# EAGLE design H0BR41 (EAGLE 9.6.2)

## Sheet 1 of 2
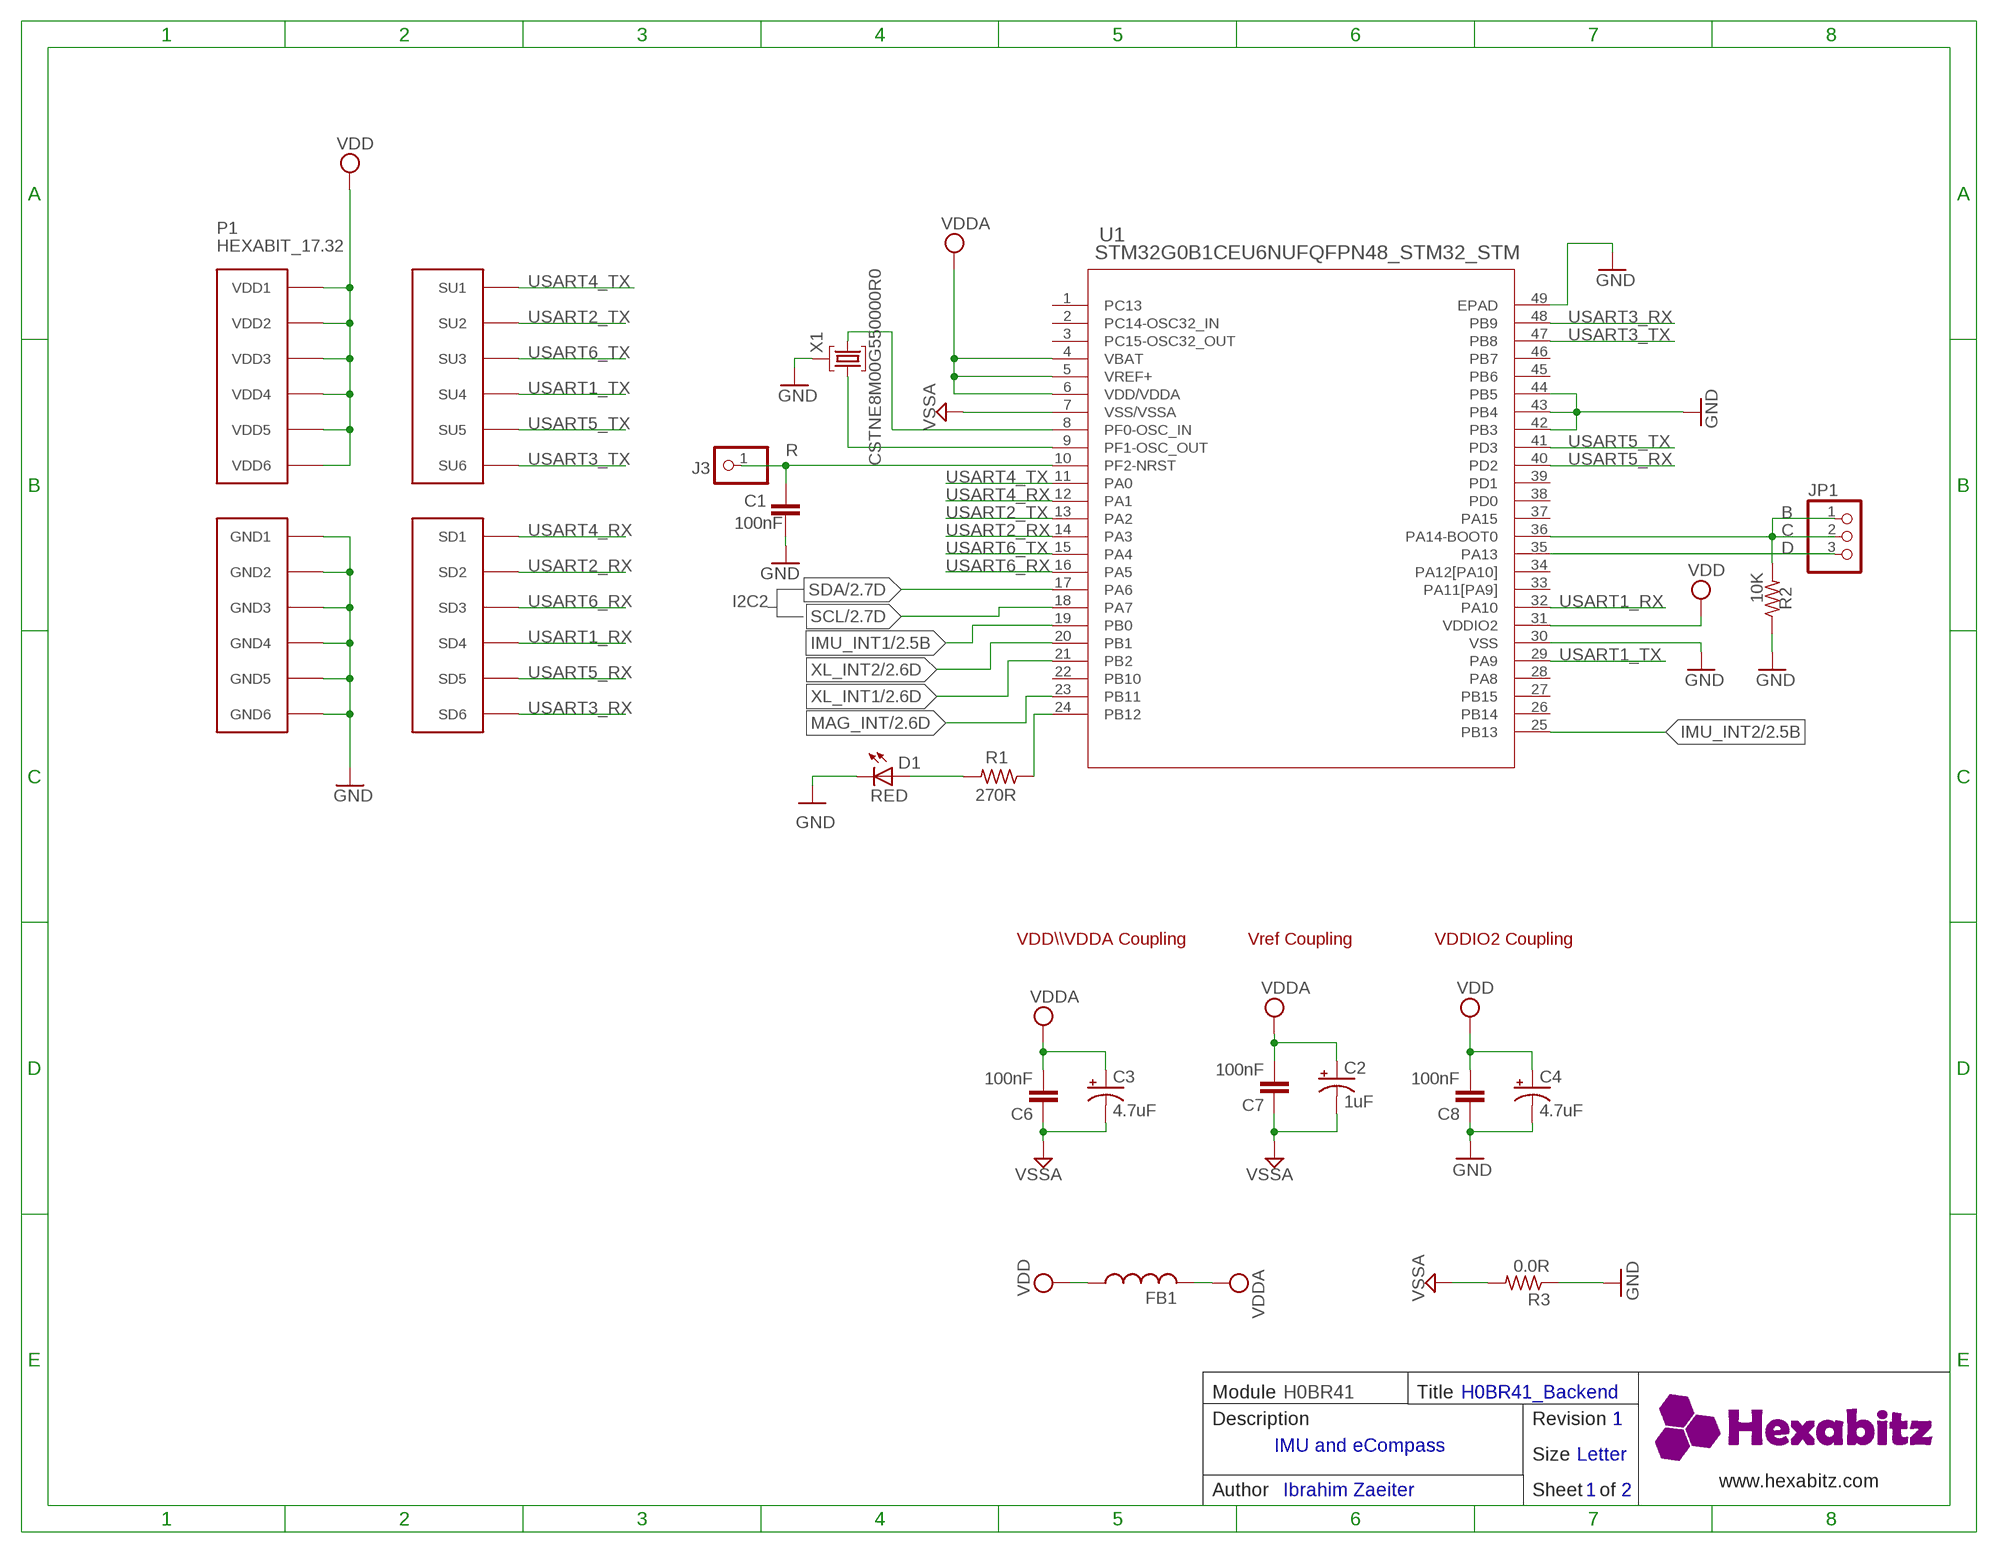
[diagram p0: schematic, sheet 1]

### Parts
C1  100nF  C-0603  [C-0603]
C2  1uF  C-0805-POL  [C-0805-POL]
C3  4.7uF  C-0805-POL  [C-0805-POL]
C4  4.7uF  C-0805-POL  [C-0805-POL]
C6  100nF  C-0603  [C-0603]
C7  100nF  C-0603  [C-0603]
C8  100nF  C-0603  [C-0603]
D1  RED  VLMS1300-GS08  [VLMS1300-GS08]
FB1  FB-TDK_MMZ1608Y300B  [FB-TDK_MMZ1608Y300B]
J3  PINHD-1X1  [1X01]
JP1  PINHD-1X3  [1X03]
P1  HEXABIT_17.32  [HEXABIT_17.32]
R1  270R  R-0603  [R-0603]
R2  10K  R-0603  [R-0603]
R3  0.0R  R-0603  [R-0603]
U1  STM32G0B1CEU6NUFQFPN48_STM32_STM  [UFQFPN48_STM32_STM]
X1  CSTNE8M00G550000R0  XTALL_CSTCE8M00G52  [XTALL_CSTCE8M00G52]

### Nets
C: JP1.1 JP1.2 R2.2 U1.36(PA14-BOOT0)
D: JP1.3 U1.35(PA13)
GND: C1.1 C4.2(-) C8.1 D1.C P1.PAD_PD7(GND1) P1.PAD_PD8(GND2) P1.PAD_PD9(GND3) P1.PAD_PD10(GND4) P1.PAD_PD11(GND5) P1.PAD_PD12(GND6) R2.1 R3.1 U1.30(VSS) U1.42(PB3) U1.43(PB4) U1.44(PB5) U1.49(EPAD) X1.P$2 ; also sheet 2
GND1: C2.2(-) C3.2(-) C6.1 C7.1 R3.2 U1.7(VSS/VSSA) ; supply symbol labelled VSSA
IMU_INT1: U1.19(PB0) ; also sheet 2
IMU_INT2: U1.25(PB13) ; also sheet 2
MAG_INT: U1.23(PB11) ; also sheet 2
N$1: R1.1 U1.24(PB12)
N$3: U1.9(PF1-OSC_OUT) X1.P$3
N$4: D1.A R1.2
N$5: U1.8(PF0-OSC_IN) X1.P$1
R: C1.2 J3.1 U1.10(PF2-NRST)
SCL: U1.18(PA7) ; also sheet 2
SDA: U1.17(PA6) ; also sheet 2
USART1_RX: P1.PAD_PD4(SD4) U1.32(PA10)
USART1_TX: P1.PAD_PU4(SU4) U1.29(PA9)
USART2_RX: P1.PAD_PD2(SD2) U1.14(PA3)
USART2_TX: P1.PAD_PU2(SU2) U1.13(PA2)
USART3_RX: P1.PAD_PD6(SD6) U1.48(PB9)
USART3_TX: P1.PAD_PU6(SU6) U1.47(PB8)
USART4_RX: P1.PAD_PD1(SD1) U1.12(PA1)
USART4_TX: P1.PAD_PU1(SU1) U1.11(PA0)
USART5_RX: P1.PAD_PD5(SD5) U1.40(PD2)
USART5_TX: P1.PAD_PU5(SU5) U1.41(PD3)
USART6_RX: P1.PAD_PD3(SD3) U1.16(PA5)
USART6_TX: P1.PAD_PU3(SU3) U1.15(PA4)
VCC: C2.1(+) C3.1(+) C6.2 C7.2 FB1.2 U1.4(VBAT) U1.5(VREF+) U1.6(VDD/VDDA) ; supply symbol labelled VDDA
VDD: C4.1(+) C8.2 FB1.1 P1.PAD_PU7(VDD1) P1.PAD_PU8(VDD2) P1.PAD_PU9(VDD3) P1.PAD_PU10(VDD4) P1.PAD_PU11(VDD5) P1.PAD_PU12(VDD6) U1.31(VDDIO2) ; also sheet 2
XL_INT1: U1.21(PB2) ; also sheet 2
XL_INT2: U1.20(PB1) ; also sheet 2
Unconnected: U1.1(PC13) U1.2(PC14-OSC32_IN) U1.3(PC15-OSC32_OUT) U1.22(PB10) U1.26(PB14) U1.27(PB15) U1.28(PA8) U1.33(PA11[PA9]) U1.34(PA12[PA10]) U1.37(PA15) U1.38(PD0) U1.39(PD1) U1.45(PB6) U1.46(PB7)

### Notes on the sheet
- B
- I2C2
- VDD\\\VDDA Coupling | Vref Coupling | VDDIO2 Coupling
- Module | H0BR41 | Title | H0BR41_Backend
- Description | Revision | 1
- IMU and eCompass
- Size | Letter
- www.hexabitz.com
- Author | Ibrahim Zaeiter | Sheet   of | 1 | 2
- C:/Users/Admin/Desktop/logodraft.bmp

## Sheet 2 of 2
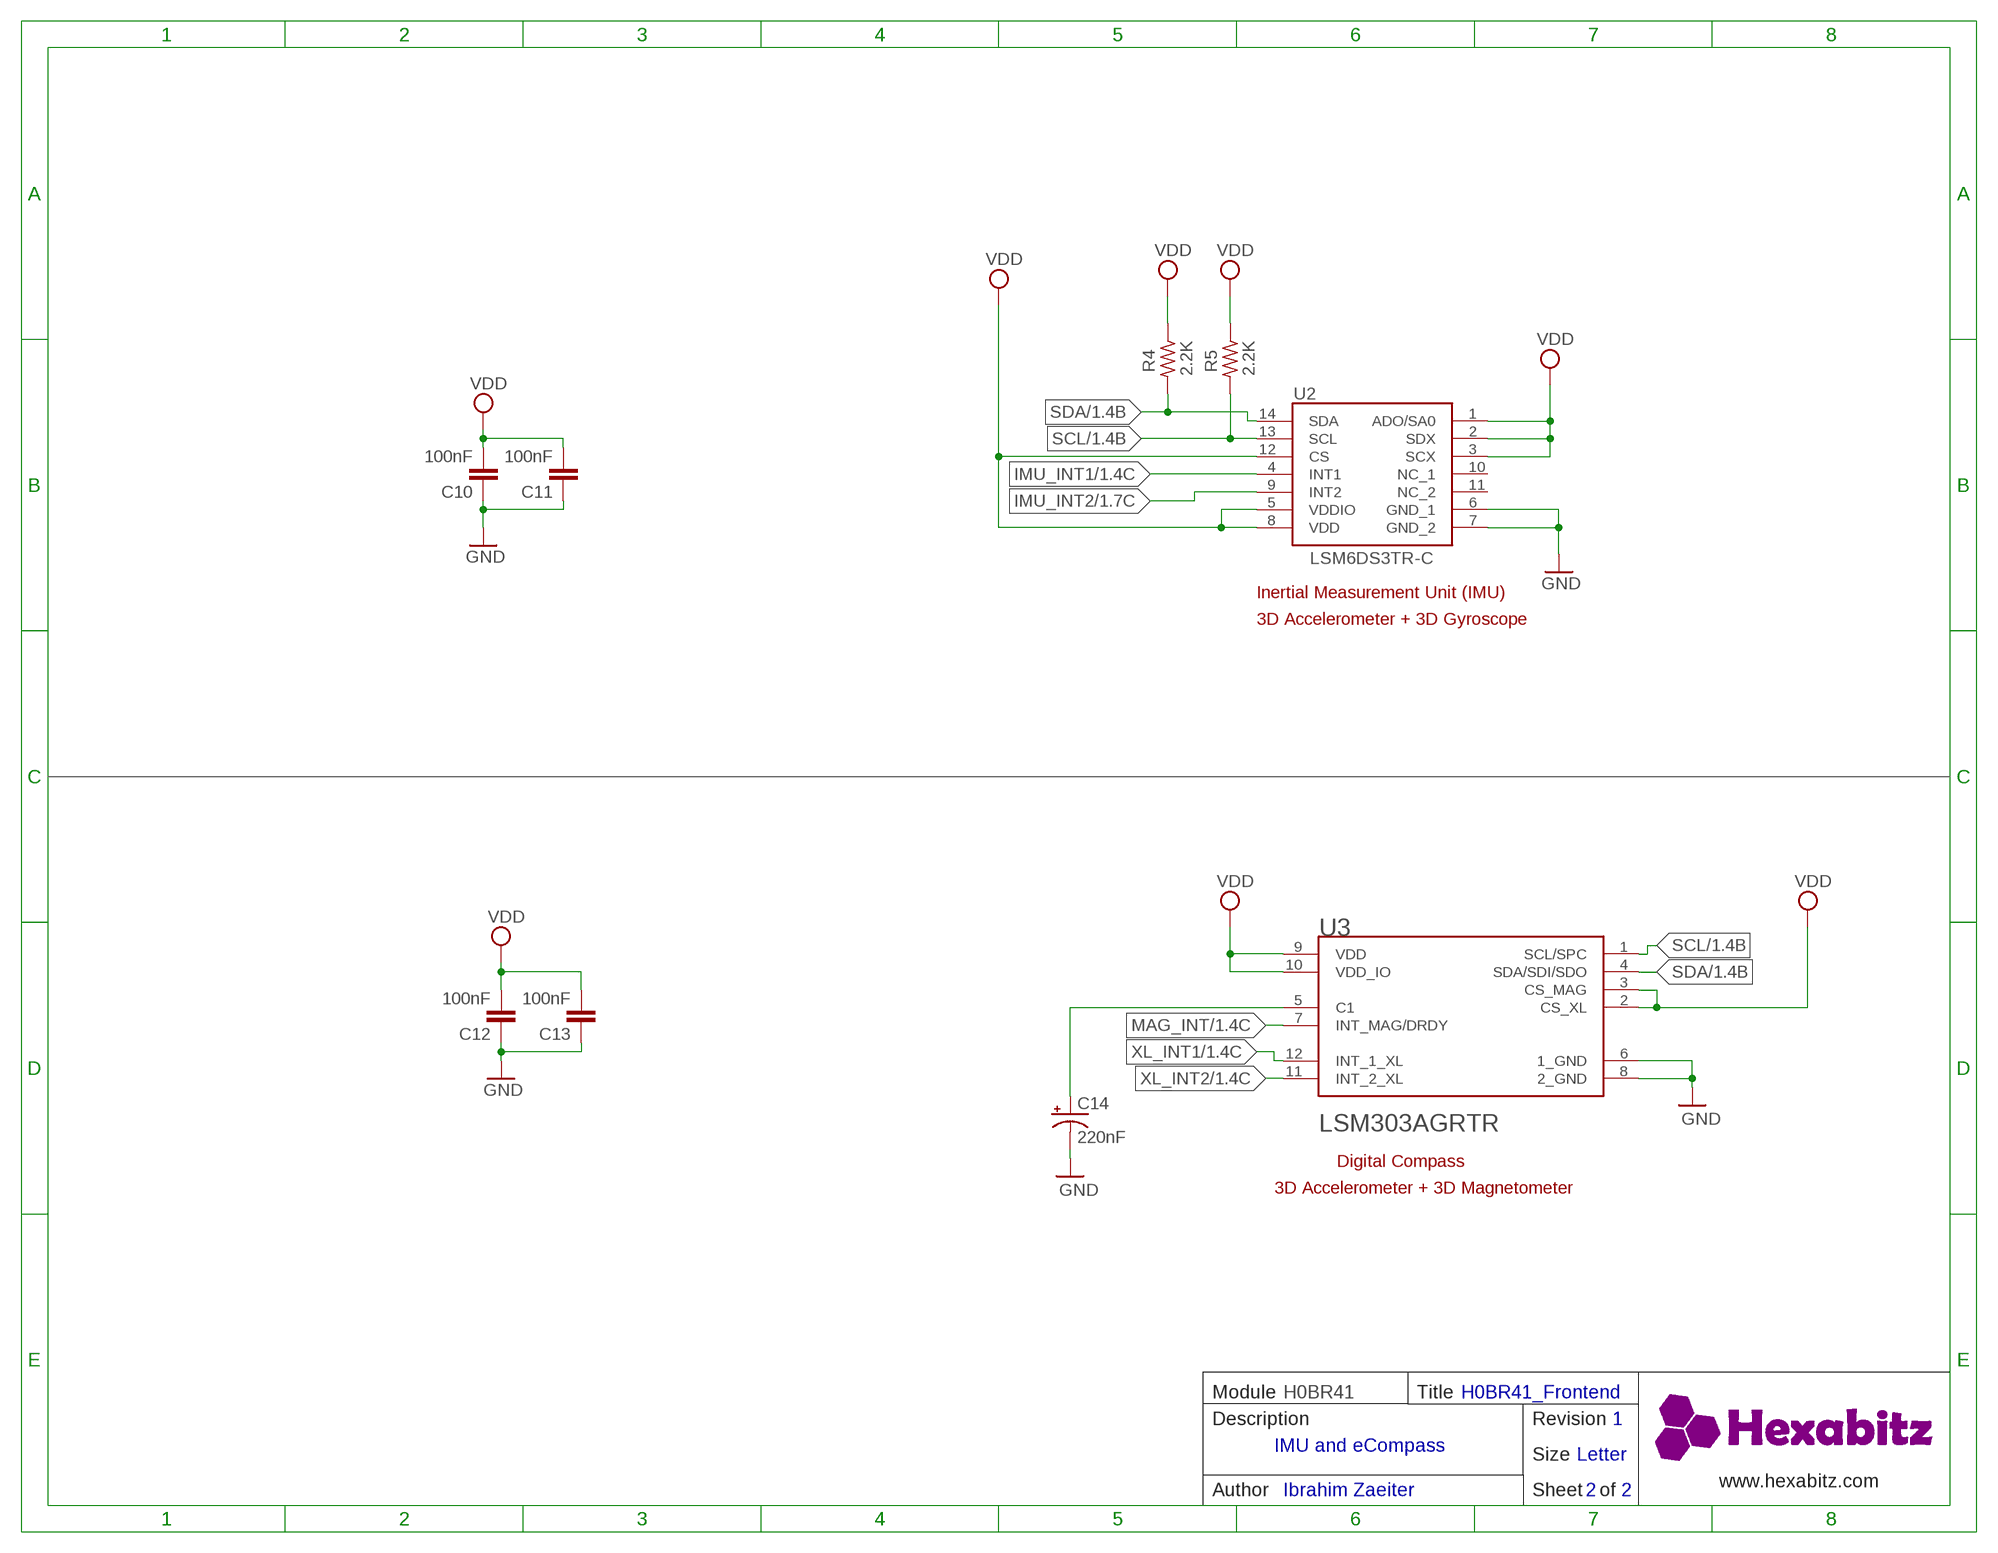
[diagram p1: schematic, sheet 2]

### Parts
C10  100nF  C-0603  [C-0603]
C11  100nF  C-0603  [C-0603]
C12  100nF  C-0603  [C-0603]
C13  100nF  C-0603  [C-0603]
C14  220nF  C-0805-POL  [C-0805-POL]
R4  2.2K  R-0603  [R-0603]
R5  2.2K  R-0603  [R-0603]
U2  LSM6DS3TR-C  [LGA-14(2.5X3X0.86)]
U3  STMICROELECTRONICS_LSM303AGRTRSTMICROELECTRONICS_LSM303AGRTR_0_0  [STMICROELECTRONICS_LSM303AGRTR_0]

### Nets
GND: C10.1 C11.1 C12.1 C13.1 C14.2(-) U2.6(GND_1) U2.7(GND_2) U3.6(1_GND) U3.8(2_GND) ; also sheet 1
IMU_INT1: U2.4(INT1) ; also sheet 1
IMU_INT2: U2.9(INT2) ; also sheet 1
MAG_INT: U3.7(INT_MAG/DRDY) ; also sheet 1
N$2: C14.1(+) U3.5(C1)
SCL: R5.2 U2.13(SCL) U3.1(SCL/SPC) ; also sheet 1
SDA: R4.2 U2.14(SDA) U3.4(SDA/SDI/SDO) ; also sheet 1
VDD: C10.2 C11.2 C12.2 C13.2 R4.1 R5.1 U2.1(ADO/SA0) U2.2(SDX) U2.3(SCX) U2.5(VDDIO) U2.8(VDD) U2.12(CS) U3.2(CS_XL) U3.3(CS_MAG) U3.9(VDD) U3.10(VDD_IO) ; also sheet 1
XL_INT1: U3.12(INT_1_XL) ; also sheet 1
XL_INT2: U3.11(INT_2_XL) ; also sheet 1
Unconnected: U2.10(NC_1) U2.11(NC_2)

### Notes on the sheet
- Inertial Measurement Unit (IMU)
- 3D Accelerometer + 3D Gyroscope
- Digital Compass
- 3D Accelerometer + 3D Magnetometer
- Module | H0BR41 | Title | H0BR41_Frontend
- Description | Revision | 1
- IMU and eCompass
- Size | Letter
- www.hexabitz.com
- Author | Ibrahim Zaeiter | Sheet   of | 2 | 2

## Library data of the parts
C1 C6-C8 C10-C13 = HEXABITZ_RCLS:C-0603: CAP CER 10% X7R 0603; CAPACITANCE: 100nF; MFN: AVX CORPORATION; MPN: '0603YC104K4T2A; OCTOPART_URL: 'https://octopart.com/0603yc104k4t2a-avx+interconnect+%2F+elco-8120651; TOLERANCE: 10%; VOLTAGE_RATING: 16.0 V
C2 = HEXABITZ_RCLS:C-0805-POL: Cap Tant Solid SMD 2012; CAPACITANCE: 1.00uF; MFN: 'YAGEO [VA]; MPN: 'CC0805KKX7R7BB105; OCTOPART_URL: https://octopart.com/cc0805kkx7r7bb105-yageo-8376555?r=sp; TOLERANCE: 10%; VOLTAGE_RATING: 16.0 V
C3 C4 = HEXABITZ_RCLS:C-0805-POL: Cap Tant Solid SMD 2012; CAPACITANCE: 4.7uF; MFN: Panasonic; MPN: 10TPU4R7MSI; OCTOPART_URL: https://octopart.com/10tpu4r7msi-panasonic-29487748; TOLERANCE: 20%; VOLTAGE_RATING: 10.0 V
C14 = HEXABITZ_RCLS:C-0805-POL: Cap Tant Solid SMD 2012; CAPACITANCE: 4.7uF; MFN: KEMET; MPN: C0805C224K1RACTU; OCTOPART_URL: https://octopart.com/c0805c224k1ractu-kemet-12818106?r=sp; TOLERANCE: 20%; VOLTAGE_RATING: 10.0 V
D1 = HEXABITZ_USER_INTERFACE_PARTS:VLMS1300-GS08: Red 0603 130° Clear 54 mcd 2 V Surface Mount ChipLED ; Octopart Url : http://octopart.com/vlms1300-gs08-vishay-21709201; MFN: Vishay; MPN: VLMS1300-GS08; OCTOPART_URL: https://octopart.com/vlms1300-gs08-vishay-21709201?r=sp&s=0nXJNjGsSbWwqfqWlZv0EA
FB1 = HEXABITZ_RCLS:FB-TDK_MMZ1608Y300B: Ferrite Beads Multi-Layer 30Ohm 25% 100MHz 1.5A 50mOhm DCR 0603; MFN: TDK; MPN: MMZ1608Y300BTA00; OCTOPART_URL: https://octopart.com/mmz1608y300bta00-tdk-7906990?r=sp
J3 = HEXABITZ_USER_INTERFACE_PARTS:PINHD-1X1: PIN HEADER; MFN: TE Connectivity; MPN: 87227-1; OCTOPART_URL: https://octopart.com/87227-1-te+connectivity-39512052?r=sp
JP1 = pinhead:PINHD-1X3: PIN HEADER
P1 = hexabitz_connectors:HEXABIT_?: Hexabitz Hexagon Module Connector Hexagon side length = 28.87mm.
R1 = HEXABITZ_RCLS:R-0603: Thick Film Resistors - SMD 0603; MFN: 'Panasonic; MPN: 'ERJ-3GEYJ271V; OCTOPART_URL: https://octopart.com/erj-3geyj271v-panasonic-55560546?r=sp; RESISTANCE: 270R
R2 = HEXABITZ_RCLS:R-0603: Thick Film Resistors - SMD 0603; MFN: Vishay; MPN: '060300J0103T5E; OCTOPART_URL: https://octopart.com/search?q=060300J0103T5E&currency=USD&specs=0; RESISTANCE: 10K
R3 = HEXABITZ_RCLS:R-0603: Thick Film Resistors - SMD 0603; MFN: YAGEO [VR]; MPN: RC0603JR-070RL; OCTOPART_URL: https://octopart.com/rc0603jr-070rl-yageo-1241539?r=sp; RESISTANCE: 0R
R4 R5 = HEXABITZ_RCLS:R-0603: Thick Film Resistors - SMD 0603; MFN: Yageo; MPN: RC0603FR-072K2L; OCTOPART_URL: https://octopart.com/rc0603fr-072k2l-yageo-1214512?r=sp; RESISTANCE: 2.2K Ohm; TOLERANCE: 5%
U1 = HEXABITZ_ICs:STM32G0B1CEU6N; COPYRIGHT: Copyright (C) 2022 Ultra Librarian. All rights reserved.; MFN: STMicroelectronics; MPN: STM32G0B1CEU6N; OCTOPART_URL: https://app.ultralibrarian.com/details/c038d58b-752a-11eb-9033-0a34d6323d74/STMicroelectronics/STM32G0B1CEU6N?uid=116364672
U2 = HEXABITZ_ICs:LSM6DS3TR-C: STMicroelectronics iNEMO inertial module: 3D accelerometer and 3D gyroscope Source: Datasheet <http://www.st.com/resource/en/datasheet/lsm6ds3tr-c.pdf>; DESCRIPTION: STMicroelectronics iNEMO inertial module: 3D accelerometer and 3D gyroscope; HEIGHT: mm; MFN: STMicroelectronics; MPN: LSM6DS3TR-C; OCTOPART_ID: b93b7300354766fc; OCTOPART_URL: https://www.mouser.com/Search/Refine.aspx?Keyword=N%2FA
U3 = HEXABITZ_ICs:STMICROELECTRONICS_LSM303AGRTR: Accelerometer, Magnetometer, Temperature, 3 Axis Sensor I²C, SPI Output; ACCEL_RANGE: 2/4/8/16g; ACCEL_RESOLUTION: 16bits; AUTOMOTIVE: No; CENTROID_NOT_SPECIFIED: No; DATASHEET: https://www.st.com/resource/en/datasheet/lsm303agr.pdf; DEVICE_CLASS_L1: Sensors; DEVICE_CLASS_L2: Motion Sensors; DEVICE_CLASS_L3: Inertial Measurement Units (IMUs); DIGIKEY_DESCRIPTION: IMU ACCEL/MAG I2C/SPI 12LGA; DIGIKEY_PART_NUMBER: 497-16527-1-ND; FOOTPRINT_URL: https://www.st.com/content/ccc/resource/technical/document/technical_note/73/17/9c/16/dd/96/4a/01/CD00134799.pdf/files/CD00134799.pdf/jcr:content/translations/en.CD00134799.pdf; FOOTPRINT_VARIANT_NAME_0: Recommended_Land_Pattern; HEIGHT: 1mm; LEAD_FREE: Yes; MAG_SENSE_RANGE: 49.152gauss (g); MAX_SUPPLY_VOLTAGE: 3.6V; MFG_PACKAGE_IDENT: LGA-12-8487206; MFG_PACKAGE_IDENT_DATE: 0; MFG_PACKAGE_IDENT_REV: 3; MFN: STMicroelectronics; MIN_SUPPLY_VOLTAGE: 1.71V; MOUSER_DESCRIPTION: IMUs - Inertial Measurement Units Ultra-compact high-performance e-compass 3D accelerometer and 3D magnetometer module; MOUSER_PART_NUMBER: 511-LSM303AGRTR; MPN: LSM303AGRTR; OCTOPART_URL: https://octopart.com/lsm303agrtr-stmicroelectronics-59386630?r=sp; OPERATING_SUPPLY_CURRENT: 3.7-200uA; PACKAGE: LGA12; PREFIX: U; RESOLUTION: 16bits; ROHS: Yes; SENSOR_OUTPUT: I2C,SPI; SENSOR_TYPE: Temperature,Accelerometer,Magnetometer; TEMPERATURE_RANGE_HIGH: +85°C; TEMPERATURE_RANGE_LOW: -40°C; VERIFICATION_VERSION: 0.0.0.3
X1 = HEXABITZ_OTHER_PARTS:XTALL_CSTCE8M00G52: MURATA CSTCE8M00G52-R0 RESONATOR, SMD, 8MHZ ; Octopart Url : https://octopart.com/cstce8m00g52-r0-murata-7145559; MFN: Murata; MPN: CSTNE8M00G550000R0; OCTOPART_URL: https://octopart.com/cstne8m00g550000r0-murata-91406934?r=sp

## Board
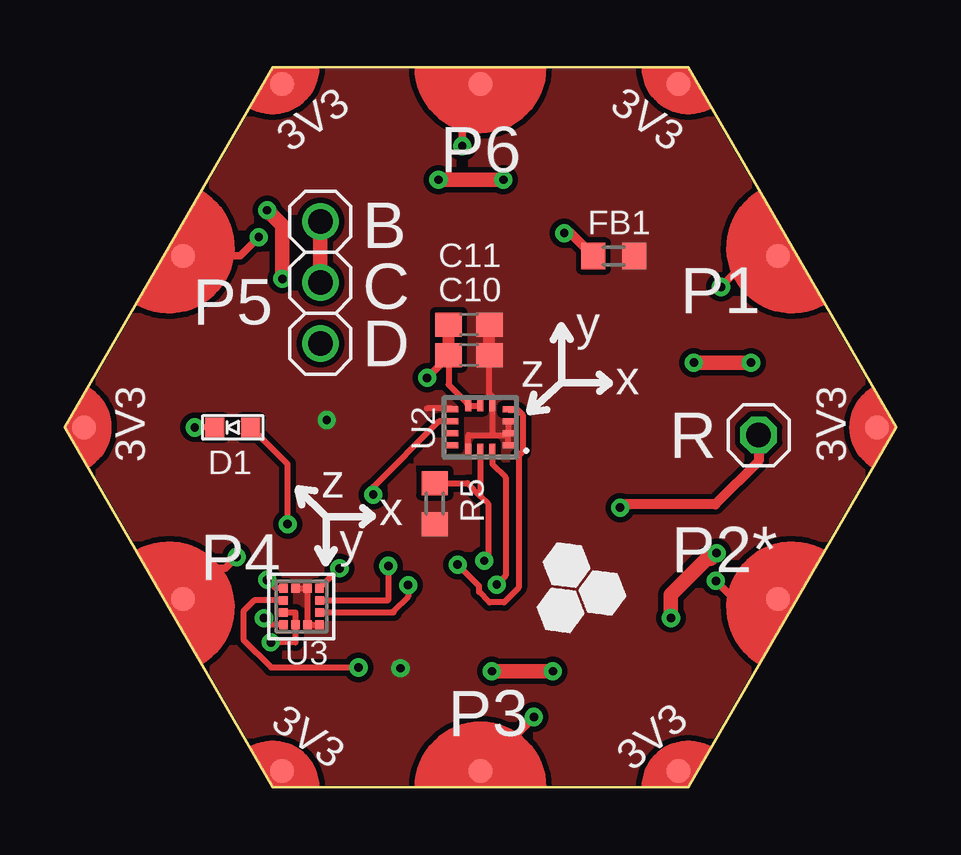
[diagram p2: board, top side]
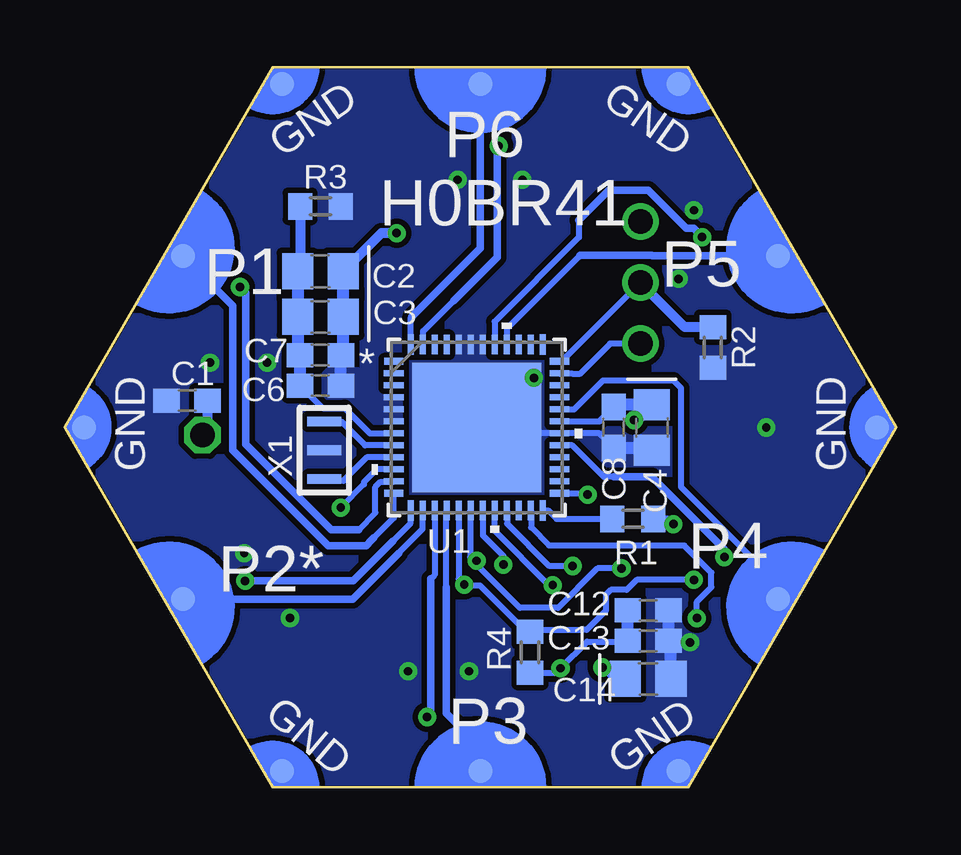
[diagram p3: board, bottom side, seen from below]

Size 34.64 x 30 mm. Coordinates in mm from the lower left corner, seen from the top.
Copper layers (1*16): Top 0.035mm / dielectric 1.5mm / Bottom 0.035mm
Design rules "2_layer *": minimum track width 7mil, minimum drill 10mil, track to track 9mil, track to pad 9mil, pad to pad 9mil, via to via 9mil, smd to smd 0mil, copper to edge 1mil, drill to drill 8mil, minimum pad ring 10mil, minimum via ring 8mil, stop-mask expansion 2mil, vias tented up to drill 15mil, thermal gap 10mil

### Footprints (pad centres in the part's own frame; a part is rotated, then mirrored left to right if it is on the bottom)
C-0603 = smd 1.1 x 1: 1 -0.85,0; 2 0.85,0
C-0805-POL = smd 1.3 x 1.5: 1 -0.95,0; 2 0.95,0
VLMS1300-GS08 = smd 0.8 x 0.8: A 0,0.75; C 0,-0.75
FB-TDK_MMZ1608Y300B = smd 1 x 1.1: 1 -0.85,0; 2 0.85,0
1X01 = drill 1.016 octagon: 1 0,0
1X03 = drill 1.016: 1 -2.54,0; 2 0,0; 3 2.54,0
HEXABIT_17.32 = smd 1 x 1 bottom: PAD_PD1 12.39,7.15; PAD_PD2 12.39,-7.15; PAD_PD3 0,-14.31; PAD_PD4 -12.39,-7.15; PAD_PD5 -12.39,7.15; PAD_PD6 0,14.31; PAD_PD7 8.26,14.31; PAD_PD8 16.52,0; PAD_PD9 8.26,-14.31; PAD_PD10 -8.26,-14.31; PAD_PD11 -16.52,0; PAD_PD12 -8.26,14.31 | smd 1 x 1: PAD_PU1 12.39,7.15; PAD_PU2 12.39,-7.15; PAD_PU3 0,-14.31; PAD_PU4 -12.39,-7.15; PAD_PU5 -12.39,7.15; PAD_PU6 0,14.31; PAD_PU7 8.26,14.31; PAD_PU8 16.52,0; PAD_PU9 8.26,-14.31; PAD_PU10 -8.26,-14.31; PAD_PU11 -16.52,0; PAD_PU12 -8.26,14.31
R-0603 = smd 1 x 1.1: 1 -0.85,0; 2 0.85,0
UFQFPN48_STM32_STM = smd 0.813 x 0.254: 1 -3.454,2.751; 2 -3.454,2.251; 3 -3.454,1.75; 4 -3.454,1.25; 5 -3.454,0.75; 6 -3.454,0.25; 7 -3.454,-0.25; 8 -3.454,-0.75; 9 -3.454,-1.25; 10 -3.454,-1.75; 11 -3.454,-2.251; 12 -3.454,-2.751; 25 3.454,-2.751; 26 3.454,-2.251; 27 3.454,-1.75; 28 3.454,-1.25; 29 3.454,-0.75; 30 3.454,-0.25; 31 3.454,0.25; 32 3.454,0.75; 33 3.454,1.25; 34 3.454,1.75; 35 3.454,2.251; 36 3.454,2.751 | smd 0.254 x 0.813: 13 -2.751,-3.454; 14 -2.251,-3.454; 15 -1.75,-3.454; 16 -1.25,-3.454; 17 -0.75,-3.454; 18 -0.25,-3.454; 19 0.25,-3.454; 20 0.75,-3.454; 21 1.25,-3.454; 22 1.75,-3.454; 23 2.251,-3.454; 24 2.751,-3.454; 37 2.751,3.454; 38 2.251,3.454; 39 1.75,3.454; 40 1.25,3.454; 41 0.75,3.454; 42 0.25,3.454; 43 -0.25,3.454; 44 -0.75,3.454; 45 -1.25,3.454; 46 -1.75,3.454; 47 -2.251,3.454; 48 -2.751,3.454 | smd 5.385 x 5.385: 49 0,0
LGA-14(2.5X3X0.86) = smd 0.475 x 0.25: 1 -1.163,0.75; 2 -1.163,0.25; 3 -1.163,-0.25; 4 -1.163,-0.75; 8 1.163,-0.75; 9 1.163,-0.25; 10 1.163,0.25; 11 1.163,0.75 | smd 0.25 x 0.475: 5 -0.5,-0.912; 6 0,-0.912; 7 0.5,-0.912; 12 0.5,0.912; 13 0,0.912; 14 -0.5,0.912
STMICROELECTRONICS_LSM303AGRTR_0 = smd 0.375 x 0.35: 1 -0.762,0.75; 2 -0.762,0.25; 3 -0.762,-0.25; 4 -0.762,-0.75; 7 0.762,-0.75; 8 0.762,-0.25; 9 0.762,0.25; 10 0.762,0.75 | smd 0.35 x 0.375: 5 -0.25,-0.762; 6 0.25,-0.762; 11 0.25,0.762; 12 -0.25,0.762
XTALL_CSTCE8M00G52 = smd 1.4 x 0.4: P$1 0,1.2; P$2 0,0; P$3 0,-1.2

### Placement (x,y rotation side)
C1  29.54,16.11 0 bottom
C2  23.99,21.51 180 bottom
C3  23.99,19.6 180 bottom
C4  10.18,15 270 bottom
C6  23.99,16.75 0 bottom
C7  23.99,18.02 0 bottom
C8  11.76,15 90 bottom
C10  16.84,18.02 0 top
C11  16.84,19.29 0 top
C12  10.33,7.38 180 bottom
C13  10.33,6.11 180 bottom
C14  10.33,4.52 0 bottom
D1  7,15 270 top
FB1  22.88,22.14 180 top
J3  28.91,14.68 0 top
JP1  10.65,21.03 270 top
P1  17.32,15 0 top
R1  10.97,11.19 0 bottom
R2  7.64,18.33 90 bottom
R3  23.99,24.21 180 bottom
R4  15.26,5.63 90 bottom
R5  15.41,11.82 90 top
U1  17.48,15 0 bottom
U2  17.32,15 180 top
U3  9.86,7.54 270 top
X1  23.83,14.05 0 bottom

### Tracks (layer width: path | path; a pad name or v marks a point on that pad's centre or on a via)
C
  Top 0.61: JP1.2 JP1.1
  Bottom 0.254: JP1.2 13.93,17.75 U1.36
  Bottom 0.406: R2.2 8.8,19.18 JP1.2
D
  Bottom 0.254: JP1.3 11.92,18.49 13.19,17.22 13.46,17.22 13.47,17.23 14.01,17.23 U1.35
GND  (via drill 0.35)
  Top 0.254: U3.6 9.61,7.29 U3.8 9.61,6.04 v8.59,6.04 | U2.6 U2.7 16.75,15.98 16.75,16.02 15.99,16.78 C10.1 | D1.C v5.41,15
  Top 0.305: C10.1 15.99,17.96 v15.1,17.06
  Top 0.508: C10.1 C11.1
  Top 0.61: v26.21,17.7 v28.59,17.7 | v27.16,9.76 26.92,9.52 26.75,9.52 25.26,8.03 v25.26,7.06 | v20.34,4.84 v17.8,4.84 | v18.27,25.32 v15.57,25.32 | v9.06,21.19 9.06,23.41 v8.43,24.05
  Bottom 0.254: C13.1 9.42,6.04 v8.59,6.04 | C8.1 12.36,14.75 U1.30 14.04,14.77 17.28,14.77 17.48,14.97 U1.49
  Bottom 0.508: C14.2 9.38,6.01 C13.1 C12.1 | C8.1 10.28,14.15 C4.2
  pour Bottom (no thermals): 0.02,15 8.59,29.92 25.89,29.92 34.46,15 25.89,0.08 8.75,0.08
GND1
  Bottom 0.254: 24.69,16.75 C6.1 23.89,15.8 22.98,15.8 21.93,14.75 U1.7
  Bottom 0.406: R3.2 24.84,21.61 C2.2
  Bottom 0.508: C6.1 C7.1 24.94,18.12 C3.2 C2.2
IMU_INT1  (via drill 0.35)
  Top 0.254: U2.4 18.5,15.73 18.87,15.73 19.08,15.52 19.08,13.98 18.91,13.81 18.91,8.32 18.3,7.71 17.69,7.71 17.26,8.14 17.26,8.39 v16.37,9.28
  Bottom 0.254: v16.37,9.28 16.37,9.65 17.21,10.49 17.21,11.53 U1.19
IMU_INT2  (via drill 0.35)
  Top 0.254: U2.9 15.59,15.25 12.85,12.52 v12.85,12.2
  Bottom 0.254: U1.25 12.9,12.25 v12.85,12.2
MAG_INT  (via drill 0.35)
  Top 0.254: U3.7 8.56,6.78 8.3,7.03 v8.3,7.05
  Bottom 0.254: v8.3,7.05 8.3,7.74 7.7,8.35 7.7,8.95 8.82,10.08 14.46,10.08 15.21,10.83 15.21,11.53 U1.23
N$1
  Bottom 0.254: U1.24 14.5,11.55 14.15,11.19 R1.1
N$2  (via drill 0.35)
  Top 0.254: U3.5 7.89,7.79 7.44,7.34 7.44,6.16 8.6,5 v12.24,5
  Bottom 0.254: v12.24,5 11.76,4.52 C14.1
N$3
  Bottom 0.254: U1.9 22.06,13.75 23.03,12.78 23.76,12.78 X1.P$3
N$4  (via drill 0.35)
  Top 0.254: v9.28,10.97 9.28,13.47 D1.A
  Bottom 0.254: v9.28,10.97 9.5,11.19 R1.2
N$5
  Bottom 0.254: U1.8 22.13,14.25 23.12,15.25 X1.P$1
R  (via drill 0.35)
  Top 0.406: v23.14,11.66 23.28,11.8 27.1,11.8 28.91,13.6 J3.1
  Bottom 0.254: v23.14,11.66 22.18,12.62 22.18,12.72 21.65,13.25 U1.10
  Bottom 0.406: J3.1 28.69,14.9 C1.2
SCL  (via drill 0.35)
  Top 0.254: U3.1 10.64,8.33 10.65,8.33 v11.45,9.13 | R5.2 16.79,12.67 17.32,12.14 | 17.32,12.14 17.64,11.82 17.64,9.6 v17.48,9.44 | U2.13 17.32,12.14
  Bottom 0.254: U1.18 17.75,11.53 17.75,9.6 v17.48,9.44 17.48,9.28 15.68,7.48 14.09,7.48 12.45,9.13 v11.45,9.13
SDA  (via drill 0.35)
  Top 0.254: U2.14 17.82,13.47 18.37,12.92 18.37,8.82 v18,8.45 | U3.4 8.78,8.3 v8.43,8.65
  Bottom 0.254: U1.17 18.23,8.68 v18,8.45 | 18.04,8.41 17.34,8.41 15.42,6.48 R4.2 15.18,6.56 14.46,6.56 14.25,6.56 13.08,6.56 13.07,6.56 12.9,6.56 12.09,7.37 12.09,8.03 11.88,8.24 11.23,8.24 10.81,8.65 v8.43,8.65
  Bottom 0.305: 18.04,8.41 v18,8.45
USART1_RX
  Bottom 0.254: U1.32 13.42,15.75 12.21,16.96 9.28,16.96 8.97,16.64 8.97,12.52 4.93,8.48 P1.PAD_PD4
USART1_TX  (via drill 0.35)
  Top 0.305: P1.PAD_PU4 6.21,9.13 6.68,9.13 v7.16,9.6
  Bottom 0.254: 11.76,12.94 12.17,12.94 13.49,14.25 U1.29
  Bottom 0.305: v7.16,9.6 7.16,9.92 10.18,12.94 11.76,12.94
USART2_RX
  Bottom 0.254: 20.72,9.76 20.7,9.79 20.7,9.8 19.73,10.77 U1.14
  Bottom 0.305: P1.PAD_PD2 22.63,7.85 20.72,9.76
USART2_TX  (via drill 0.35)
  Top 0.305: P1.PAD_PU2 27.89,7.85 v27.13,8.61
  Bottom 0.254: 20.97,10.27 20.23,11.01 U1.13
  Bottom 0.305: v27.13,8.61 22.63,8.61 20.97,10.27
USART3_RX
  Bottom 0.254: U1.48 20.23,19.55 20.18,19.6
  Bottom 0.305: 20.18,19.6 17.32,22.46 P1.PAD_PD6
USART3_TX  (via drill 0.35)
  Top 0.305: v16.56,26.73 16.56,28.55 P1.PAD_PU6
  Bottom 0.254: U1.47 19.71,18.47 19.71,19.01 18.43,20.29 18.43,20.28
  Bottom 0.305: 18.43,20.28 16.63,22.08 16.63,26.5 16.56,26.57 v16.56,26.73
USART4_RX
  Bottom 0.254: 21.84,10.32 20.93,11.23 U1.12
  Bottom 0.305: P1.PAD_PD1 27.64,20.08 27.64,14.05 23.67,10.08 22.08,10.08 21.84,10.32 21.77,10.4
USART4_TX  (via drill 0.35)
  Top 0.305: v27.34,20.85 28.64,22.15 P1.PAD_PU1
  Bottom 0.254: U1.11 20.95,12.73 21.49,12.73 21.7,12.52 21.7,11.45 22.4,10.75
  Bottom 0.305: 22.4,10.75 23.54,10.75 27.11,14.31 27.11,20.62 v27.34,20.85
USART5_RX
  Bottom 0.254: U1.40 16.21,18.47 16.21,19.13 13.19,22.14
  Bottom 0.305: P1.PAD_PD5 10.15,22.15 10.18,22.18 13.16,22.18 13.19,22.14
USART5_TX  (via drill 0.35)
  Top 0.305: P1.PAD_PU5 7.3,22.15 v8.08,22.93
  Bottom 0.254: U1.41 16.73,19.41 13.22,22.92 13.22,23.64
  Bottom 0.305: 13.22,23.64 11.98,24.87 10.33,24.87 8.74,23.29 8.44,23.29 v8.08,22.93
USART6_RX
  Bottom 0.254: U1.16 18.74,11.53 18.74,8.34 18.75,8.33
  Bottom 0.305: P1.PAD_PD3 17.32,1.66 18.75,3.09 18.75,8.33
USART6_TX  (via drill 0.35)
  Top 0.305: v19.54,2.93 19.54,2.91 P1.PAD_PU3
  Bottom 0.254: 19.39,8.69 19.23,8.85 U1.15
  Bottom 0.305: 19.39,8.69 19.39,3.09 v19.54,2.93
VCC  (via drill 0.35)
  Top 0.406: FB1.2 21.07,23.1 v20.81,23.1
  Bottom 0.406: v20.81,23.1 21.45,23.1 C2.1
  Bottom 0.508: C6.2 C7.2 23.04,18.12 C3.1 C2.1
  pour Bottom (no thermals): 20.65,16.27 21.29,16.27 22.4,17.38 23.67,17.38 23.83,17.22 23.83,16.27 23.35,15.79 22.72,15.79 21.92,15 20.65,15
VDD  (via drill 0.35)
  Top 0.254: U3.3 U3.2 U3.9 U3.10 | U2.1 18.48,14.68 | 18.48,14.68 U2.2 U2.3 | U2.12 16.82,14.68 17.82,14.68 | 17.82,14.68 18.48,14.68 | 17.82,14.68 U2.5 17.8,15.93 17.8,16.3 17.69,16.4 C10.2 | v13.99,4.97 13.78,5.17 | U2.8 16.11,15.79 15.1,15.79
  Top 0.406: 17.67,19.27 C11.2
  Top 0.508: C10.2 C11.2
  Bottom 0.254: C13.2 11.22,6.08 12.88,6.08 v13.99,4.97 14.17,4.78 R4.1 | U1.31 12.36,15.25 11.66,15.95
  Bottom 0.508: C13.2 C12.2 | C8.2 11.66,15.95 C4.1 10.82,15.31 v10.92,15.31
  pour Top (no thermals): 0.02,15 8.59,29.92 25.89,29.92 34.46,15 25.89,0.08 8.75,0.08
XL_INT1  (via drill 0.35)
  Top 0.254: U3.12 13.44,7.79 13.48,7.83 v13.48,9.22
  Bottom 0.254: U1.21 16.21,11.53 16.21,10.99 14.44,9.22 v13.48,9.22
XL_INT2  (via drill 0.35)
  Top 0.254: U3.11 13.7,7.29 13.67,7.32 14.31,7.95 v14.31,8.43
  Bottom 0.254: v14.31,8.43 14.47,8.43 16.73,10.69 U1.20

### Text on the board
tPlace: 3V3 | 3V3 | P6 | P1 | P5 | y | z | x | 3V3 | 3V3 | z | x | P4 | y | P2* | P3 | 3V3 | 3V3
bPlace: GND | GND | P6 | H0BR41 | P5 | P1 | GND | GND | P4 | U1 | P2* | P3 | GND | GND
tNames: B | C | D | R